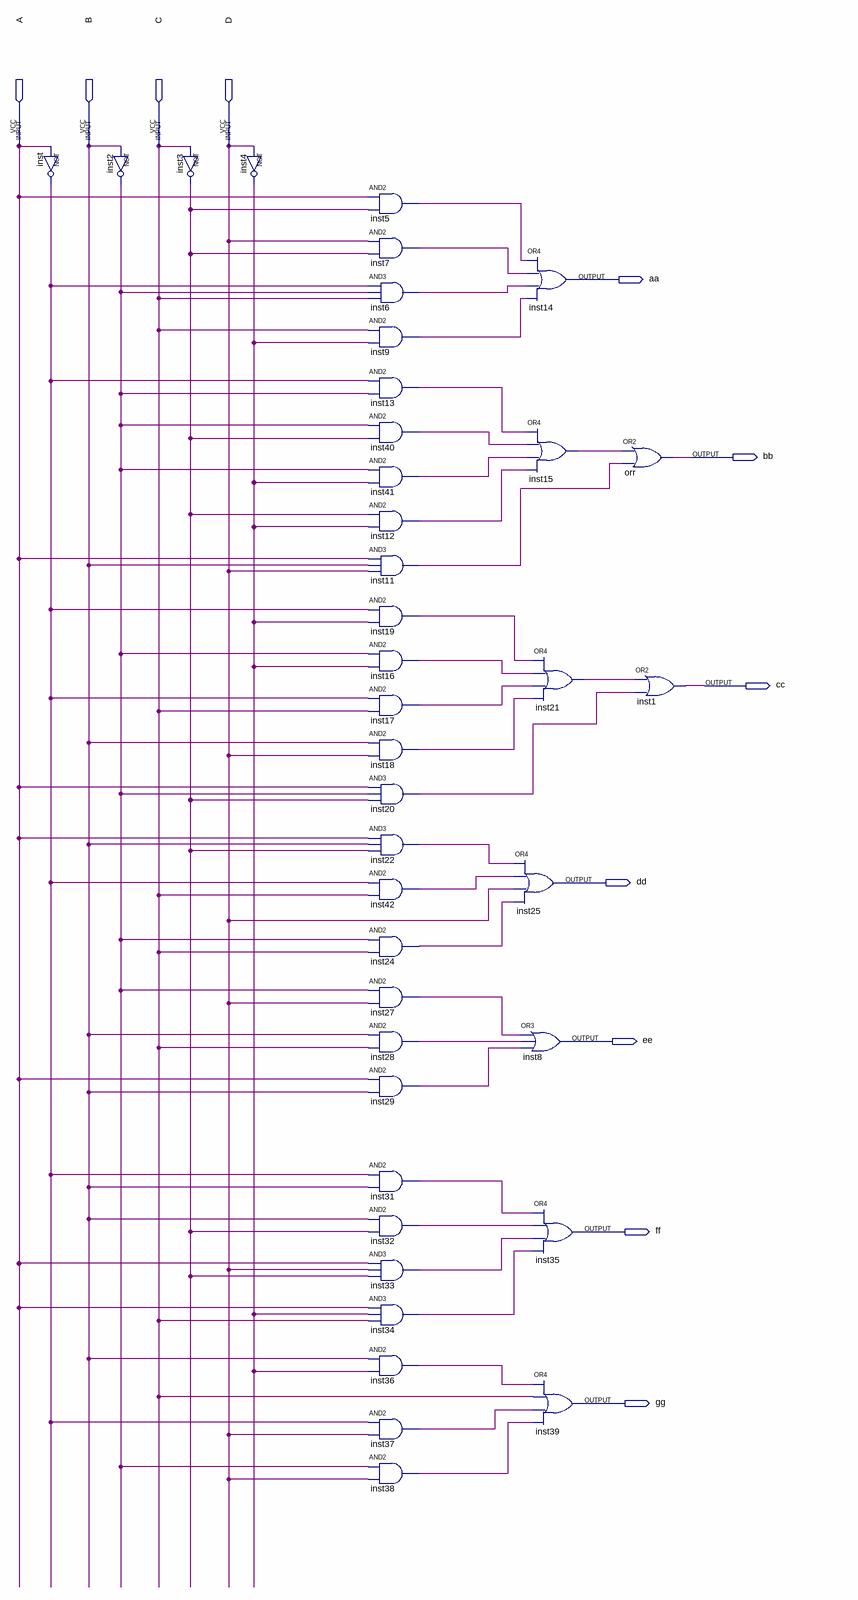
[diagram p0: schematic sheet]
// Quartus schematic DISPLAY.bdf as structural Verilog: 40 symbols, 11 pins
module DISPLAY (
  input  A,
  input  B,
  input  C,
  input  D,
  output aa,
  output bb,
  output cc,
  output dd,
  output ee,
  output ff,
  output gg
);

  wire inst2_out, inst3_out, inst4_out, inst5_out, inst6_out, inst7_out, inst9_out, inst11_out, inst12_out,
       inst13_out, inst15_out, inst16_out, inst17_out, inst18_out, inst19_out, inst20_out, inst21_out,
       inst22_out, inst24_out, inst27_out, inst28_out, inst29_out, inst31_out, inst32_out, inst33_out,
       inst34_out, inst36_out, inst37_out, inst38_out, inst40_out, inst41_out, inst42_out, inst_out;

  not inst (inst_out, A);
  not inst2 (inst2_out, B);
  not inst3 (inst3_out, C);
  not inst4 (inst4_out, D);
  and inst5 (inst5_out, A, inst3_out);
  and inst7 (inst7_out, D, inst3_out);
  and inst6 (inst6_out, inst_out, inst2_out, C);
  and inst9 (inst9_out, C, inst4_out);
  and inst13 (inst13_out, inst_out, inst2_out);
  and inst40 (inst40_out, inst2_out, inst3_out);
  and inst41 (inst41_out, inst2_out, inst4_out);
  and inst12 (inst12_out, inst3_out, inst4_out);
  and inst11 (inst11_out, A, B, D);
  and inst19 (inst19_out, inst_out, inst4_out);
  and inst16 (inst16_out, inst2_out, inst4_out);
  and inst17 (inst17_out, inst_out, C);
  and inst18 (inst18_out, B, D);
  and inst20 (inst20_out, A, inst2_out, inst3_out);
  and inst22 (inst22_out, A, B, inst3_out);
  and inst42 (inst42_out, inst_out, C);
  and inst24 (inst24_out, inst2_out, C);
  and inst27 (inst27_out, inst2_out, D);
  and inst28 (inst28_out, B, C);
  and inst29 (inst29_out, A, B);
  and inst31 (inst31_out, inst_out, B);
  and inst32 (inst32_out, B, inst3_out);
  and inst33 (inst33_out, A, D, inst3_out);
  and inst34 (inst34_out, A, inst4_out, C);
  and inst36 (inst36_out, B, inst4_out);
  and inst37 (inst37_out, inst_out, D);
  and inst38 (inst38_out, inst2_out, D);
  or inst14 (aa, inst5_out, inst7_out, inst6_out, inst9_out);
  or inst15 (inst15_out, inst13_out, inst40_out, inst41_out, inst12_out);
  or inst21 (inst21_out, inst19_out, inst16_out, inst17_out, inst18_out);
  or inst25 (dd, inst22_out, inst42_out, D, inst24_out);
  or inst8 (ee, inst27_out, inst28_out, inst29_out);
  or inst35 (ff, inst31_out, inst32_out, inst33_out, inst34_out);
  or inst39 (gg, inst36_out, C, inst37_out, inst38_out);
  or orr (bb, inst15_out, inst11_out);
  or inst1 (cc, inst21_out, inst20_out);
endmodule
